# Altium schematic sheet oxy_scheme.SchDoc
size A; DocumentNumber: 1; SheetNumber: 1; SheetTotal: 6
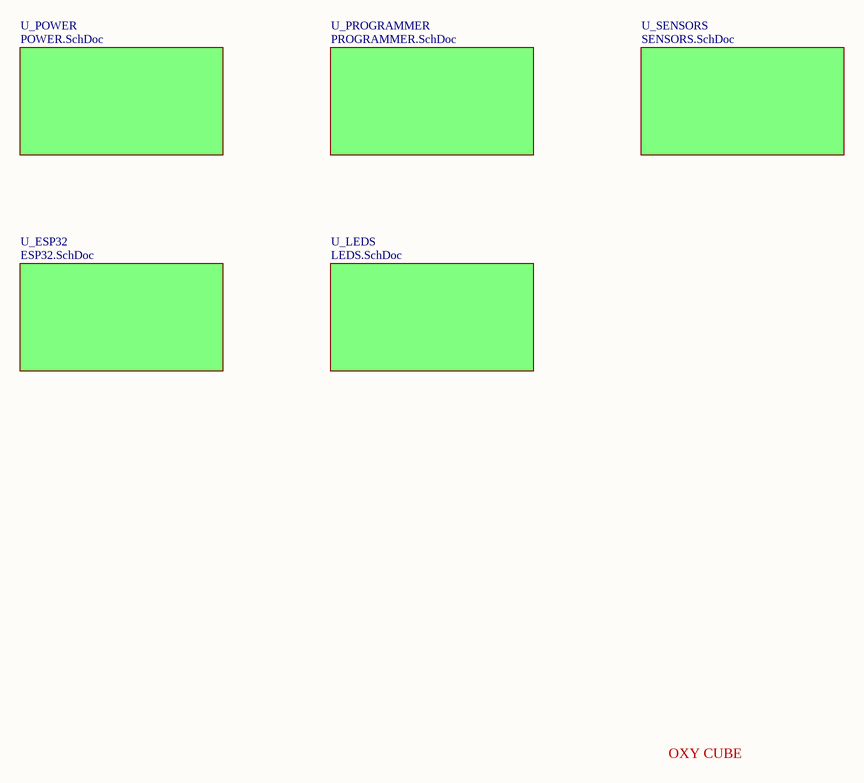
[diagram p0: oxy_scheme.SchDoc]

## Sub-sheets
U_ESP32 = ESP32.SchDoc: no entries
U_LEDS = LEDS.SchDoc: no entries
U_POWER = POWER.SchDoc: no entries
U_PROGRAMMER = PROGRAMMER.SchDoc: no entries
U_SENSORS = SENSORS.SchDoc: no entries

## Notes on the sheet
- OXY CUBE